# EAGLE design Poti (EAGLE 7.2.0)
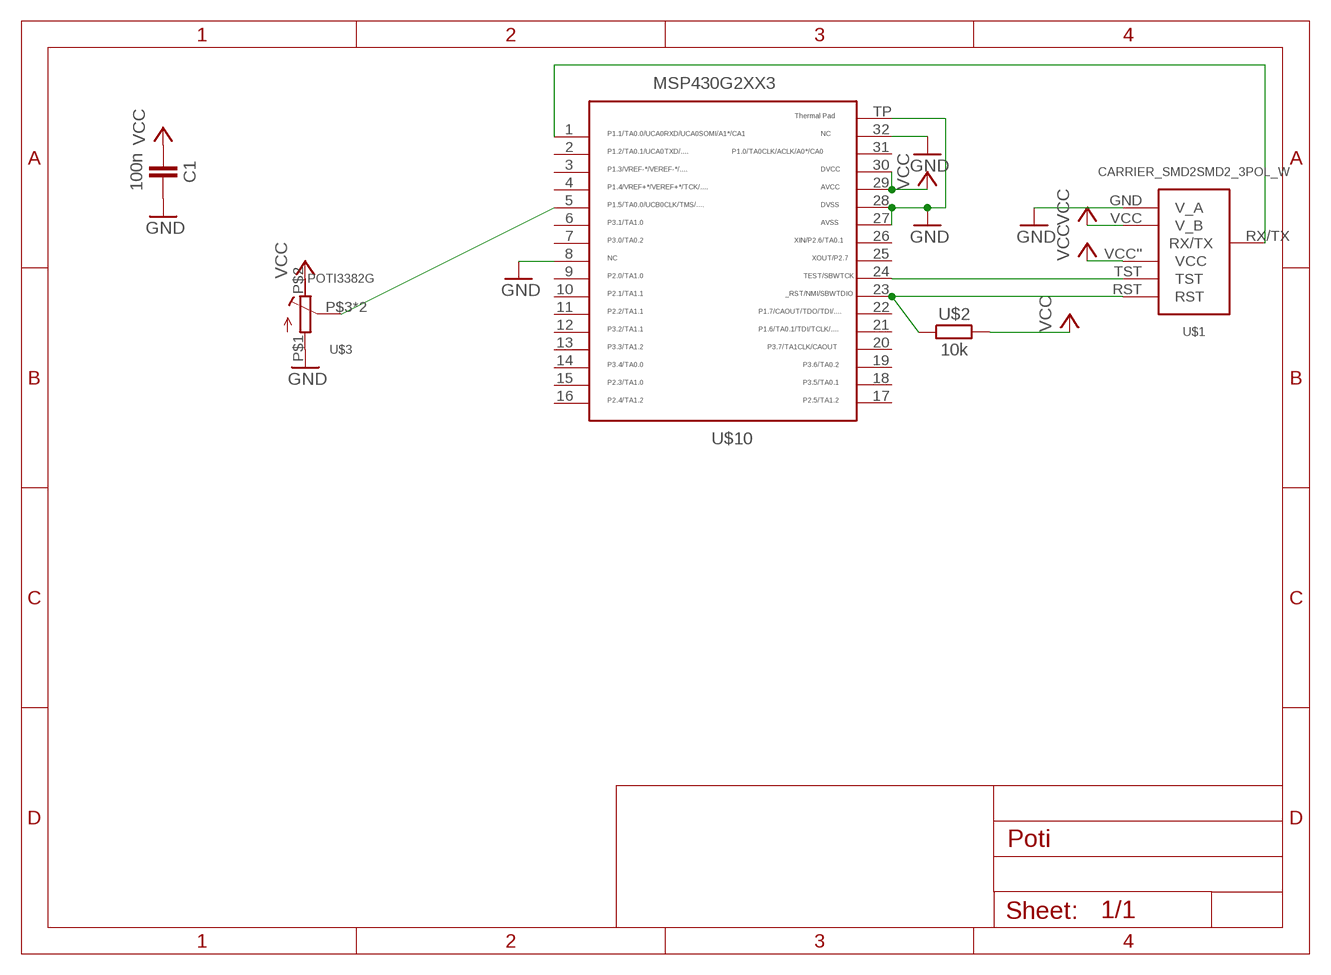
[diagram p0: schematic, sheet 1]

## Parts
C1  100n  CAPACITOR  [603]
U$1  CARRIER_SMD2SMD2_3POL_W  [CARRIER_SMD2_WIDE_3POL]
U$2  10k  RESISTOR0603  [603]
U$3  POTI3382G  [3382G]
U$10  MSP430G2553  [QFN32]

## Nets
GND: C1.2 U$1.GND(V_A) U$3.P$1(A) U$10.8 U$10.27 U$10.28 U$10.32 U$10.TP
N$2: U$3.P$3(S) U$3.P$4(S) U$10.5
N$3: U$1.TST U$10.24
N$4: U$1.RST U$2.1 U$10.23
N$12: U$1.RX/TX U$10.1
VCC: C1.1 U$1.VCC''(VCC) U$1.VCC(V_B) U$2.2 U$3.P$2(E) U$10.29 U$10.30
Unconnected: U$10.2 U$10.3 U$10.4 U$10.6 U$10.7 U$10.9 U$10.10 U$10.11 U$10.12 U$10.13 U$10.14 U$10.15 U$10.16 U$10.17 U$10.18 U$10.19 U$10.20 U$10.21 U$10.22 U$10.25 U$10.26 U$10.31

## Library data of the parts
C1 = thar:CAPACITOR
U$1 = thar:CARRIER_SMD2
U$2 = thar:RESISTOR
U$3 = thar:POTI: veränderbarer Widerstand
U$10 = thar:MSP430G2553: TEXAS INSTRUMENTS MSP430G2553IRHB32R MCU, 16BIT, MSP430, 16MHZ, QFN-32 Farnell Best.Nr.: 2325726 Herst.Bez.: MSP430G2553IRHB32R

## Board
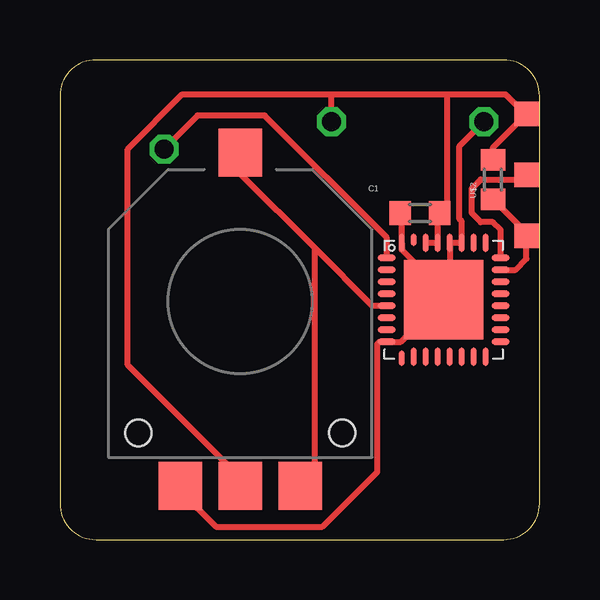
[diagram p1: board, top side]
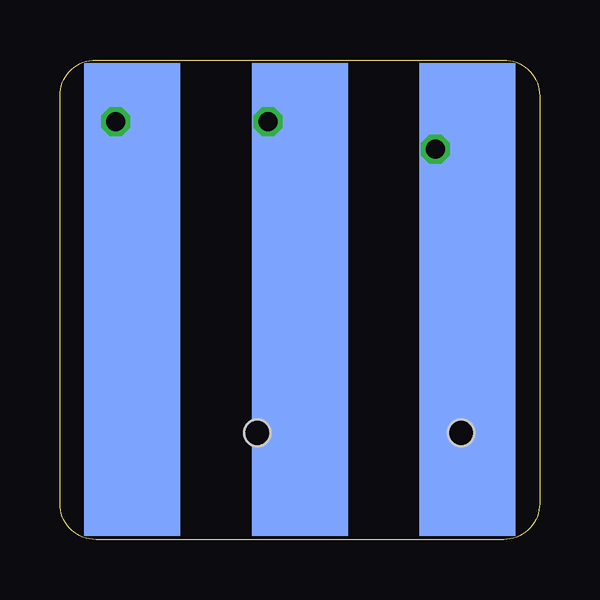
[diagram p2: board, bottom side, seen from below]

Size 20 x 20 mm. Coordinates in mm from the lower left corner, seen from the top.
Copper layers (1*16): Top 0.035mm / dielectric 1.5mm / Bottom 0.035mm
Design rules "Bilex DRU *": minimum track width 10mil, minimum drill 24mil, track to track 10mil, track to pad 10mil, pad to pad 10mil, via to via 10mil, smd to smd 10mil, copper to edge 1mil, drill to drill 8mil, minimum pad ring 10mil, minimum via ring 8mil, stop-mask expansion 4mil, vias tented up to drill 0mil, thermal gap 10mil

### Footprints (pad centres in the part's own frame; a part is rotated, then mirrored left to right if it is on the bottom)
603 = smd 0.889 x 1.016: 1 -0.826,0; 2 0.826,0
CARRIER_SMD2_WIDE_3POL = smd 4 x 19.7 bottom: GND -6.985,3.493; RX/TX 6.985,3.493; VCC 0,3.493 | smd 1.016 x 1.016: RST -9.461,0.826; TST -9.461,-1.714; VCC'' -9.461,-4.255
3382G = smd 1.8 x 2: P$1 -2.5,-7.7; P$2 0,-7.7; P$3 2.5,-7.7; P$4 0,6.2 | hole 1.1: 4.25,-5.49; -4.25,-5.49
QFN32 = smd 0.762 x 0.254: 1 -2.375,1.75; 2 -2.375,1.25; 3 -2.375,0.75; 4 -2.375,0.25; 5 -2.375,-0.25; 6 -2.375,-0.75; 7 -2.375,-1.25; 8 -2.375,-1.75; 17 2.375,-1.75; 18 2.375,-1.25; 19 2.375,-0.75; 20 2.375,-0.25; 21 2.375,0.25; 22 2.375,0.75; 23 2.375,1.25; 24 2.375,1.75 | smd 0.254 x 0.635: 9 -1.75,-2.438 | smd 0.254 x 0.762: 10 -1.25,-2.375; 11 -0.75,-2.375; 12 -0.25,-2.375; 13 0.25,-2.375; 14 0.75,-2.375; 15 1.25,-2.375; 16 1.75,-2.375; 25 1.75,2.375; 26 1.25,2.375; 27 0.75,2.375; 28 0.25,2.375; 29 -0.25,2.375; 30 -0.75,2.375; 32 -1.75,2.375 | smd 0.254 x 0.508: 31 -1.25,2.5 | smd 3.302 x 3.302: TP 0,0

### Placement (x,y rotation side)
C1  15.01,13.62 180 top
U$1  10,13.5 180 top
U$2  18.06,15.01 90 top
U$3  7.52,9.93 0 top
U$10  16,10 0 top

### Tracks (layer width: path | path; a pad name or v marks a point on that pad's centre or on a via)
GND  (via drill 0.8)
  Top 0.254: 14.15,13.46 C1.2 | U$10.TP 16.25,10.25 U$10.28 U$10.27 16.75,13.27 16.66,13.36 16.66,16.41 v17.68,17.43 | U$10.TP 16.07,9.93 16.79,9.93 15.64,11.08 15.26,11.08 14.25,12.09 U$10.32 14.25,13.55 C1.2 | U$10.TP 15.43,9.43 15.39,9.43 14.21,8.25 U$10.8 13.33,8.25 13.23,8.16 13.23,2.82 10.95,0.54 6.5,0.54 5.02,2.02 U$3.P$1 | C1.2 14.18,13.68 14.12,13.74 14.12,13.87
  Bottom 0.254: 18,13.5 17.93,13.56 v17.68,17.43 18,17.1 U$1.GND
N$2
  Top 0.254: U$10.5 13.04,9.75 10.63,12.16 | 10.63,12.16 7.52,15.27 U$3.P$4 | U$3.P$3 10.1,2.31 10.56,2.31 10.63,2.38 10.63,12.16
N$3
  Top 0.254: U$10.24 18.38,12.92 18.06,13.24 17.55,13.24 17.17,13.62 17.17,14.63 17.55,15.01 19.26,15.01 U$1.TST
N$4
  Top 0.254: U$10.23 18.99,11.25 19.45,11.71 U$1.RST 19.46,12.79 U$2.1
N$12  (via drill 0.8)
  Top 0.254: v4.34,16.28 5.74,17.68 8.53,17.68 13.62,12.59 U$10.1
  Bottom 0.254: U$1.RX/TX 3.01,14.96 v4.34,16.28
VCC  (via drill 0.8)
  Top 0.254: 19.5,17.52 19.46,17.56 | 19.2,17.56 19.2,17.51 | 19.2,17.51 19.46,17.56 | 19.65,17.95 19.65,17.82 | 19.65,17.82 19.65,17.75 19.46,17.56 | 19.65,17.82 19.59,17.75 U$1.VCC'' 18.06,16.35 U$2.2 | 19.2,17.51 19.2,17.69 19.59,18.07 19.08,18.07 18.58,18.57 16.15,18.57 | C1.1 15.52,13.56 15.97,13.56 16.03,13.62 16.15,13.62 16.15,13.87 | U$10.30 U$10.29 15.75,13.53 C1.1 | C1.1 15.9,13.62 16.15,13.87 | 16.15,13.87 16.15,18.57 | 11.33,18.57 5.1,18.57 2.83,16.28 2.83,7.28 7.52,2.58 U$3.P$2 | 11.33,18.57 16.15,18.57 | v11.33,17.43 11.33,18.57
  Bottom 0.254: U$1.VCC 10,16.35 v11.33,17.43